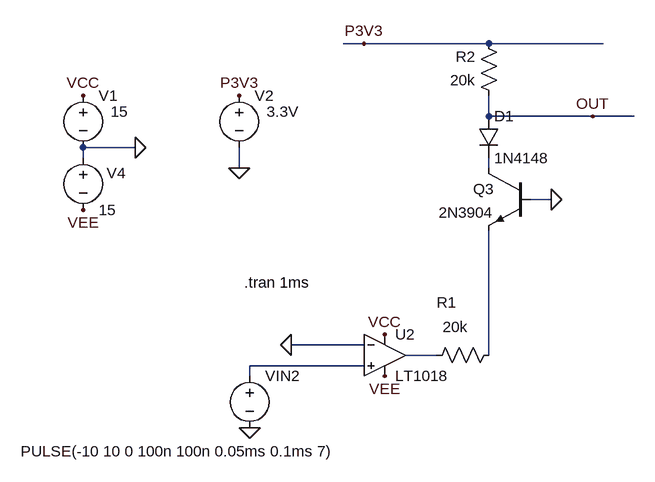
[diagram p0: schematic Draft02.asc]
Draft02.asc, the LTspice schematic file:
Version 4
SHEET 1 2756 2104
WIRE 0 -656 -32 -656
WIRE 192 -656 0 -656
WIRE 368 -656 192 -656
WIRE 192 -544 192 -576
WIRE 352 -544 192 -544
WIRE 416 -544 352 -544
WIRE -352 -496 -432 -496
WIRE -432 -480 -432 -496
WIRE -192 -464 -192 -496
WIRE 192 -464 192 -480
WIRE 288 -416 256 -416
WIRE 0 -192 -112 -192
WIRE 112 -176 64 -176
WIRE 192 -176 192 -368
WIRE 0 -160 -176 -160
WIRE -176 -144 -176 -160
FLAG -432 -576 VCC
FLAG -432 -400 VEE
FLAG -352 -496 0
FLAG 32 -208 VCC
FLAG 32 -144 VEE
FLAG -176 -64 0
FLAG -112 -192 0
FLAG 288 -416 0
FLAG -192 -576 P3V3
FLAG -192 -464 0
FLAG 0 -656 P3V3
FLAG 352 -544 OUT
SYMBOL voltage -432 -592 R0
WINDOW 123 0 0 Left 0
WINDOW 39 0 0 Left 0
WINDOW 3 42 41 Left 2
SYMATTR Value 15
SYMATTR InstName V1
SYMBOL voltage -432 -496 R0
WINDOW 123 0 0 Left 0
WINDOW 39 0 0 Left 0
WINDOW 0 36 39 Left 2
SYMATTR InstName V4
SYMATTR Value 15
SYMBOL res 208 -192 R90
WINDOW 0 -50 81 VBottom 2
WINDOW 3 -43 67 VTop 2
SYMATTR InstName R1
SYMATTR Value 20k
SYMBOL Comparators\\LT1018 32 -176 R0
SYMATTR InstName U2
SYMBOL voltage -176 -160 R0
WINDOW 123 0 0 Left 0
WINDOW 39 0 0 Left 0
WINDOW 3 -352 132 Left 2
SYMATTR Value PULSE(-10 10 0 100n 100n 0.05ms 0.1ms 7)
SYMATTR InstName VIN2
SYMBOL npn 256 -464 M0
SYMATTR InstName Q3
SYMATTR Value 2N3904
SYMBOL res 208 -560 R180
WINDOW 0 36 76 Left 2
WINDOW 3 36 40 Left 2
SYMATTR InstName R2
SYMATTR Value 20k
SYMBOL voltage -192 -592 R0
WINDOW 123 0 0 Left 0
WINDOW 39 0 0 Left 0
WINDOW 3 42 41 Left 2
SYMATTR Value 3.3V
SYMATTR InstName V2
SYMBOL diode 176 -544 R0
SYMATTR InstName D1
SYMATTR Value 1N4148
TEXT -184 -288 Left 2 !.tran 1ms

The netlist it stands for:
* Draft02.asc
V1 VCC 0 15
V4 0 VEE 15
R1 N003 N002 20k
XU2 N004 0 VCC VEE N002 LT1018  ; pins In+ In- V+ V- OUT
VIN2 N004 0 PULSE(-10 10 0 100n 100n 0.05ms 0.1ms 7)
Q3 N001 0 N003 0 2N3904
R2 OUT P3V3 20k
V2 P3V3 0 3.3V
D1 OUT N001 1N4148
.model D D
.lib standard.dio
.model NPN NPN
.model PNP PNP
.lib standard.bjt
.tran 1ms
.lib LTC1.lib
.backanno
.end